# EAGLE design untitled (EAGLE 7.2.0)
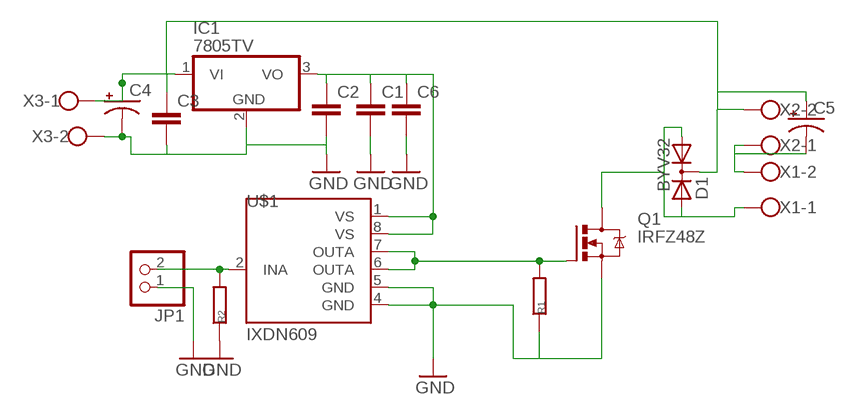
[diagram p0: schematic, sheet 1]

## Parts
C1  CC0805  [C0805]
C2  CC0805  [C0805]
C3  CC0805  [C0805]
C4  CAP_POLPTH4  [CPOL-RADIAL-1000UF-25V]
C5  CAP_POLPTH4  [CPOL-RADIAL-1000UF-25V]
C6  CC0805  [C0805]
D1  BYV32  [TO220ABS]
IC1  7805TV  [TO220V]
JP1  PINHD-1X2  [1X02]
Q1  IRFZ48Z  [TO220BH]
R1  R0805  [R0805]
R2  R0805  [R0805]
U$1  IXDN609  [SO08]
X1  W237-102  [W237-102]
X2  W237-102  [W237-102]
X3  W237-102  [W237-102]

## Nets
GND: C1.2 C2.2 C3.2 C4.- C6.2 IC1.2(GND) JP1.1 Q1.S R1.1 R2.1 U$1.4(GND) U$1.5(GND) X3.2
N$1: D1.A1 D1.A2 Q1.D X1.1
N$2: C1.1 C2.1 C6.1 IC1.3(VO) U$1.1(VS) U$1.8(VS)
N$3: Q1.G R1.2 U$1.6(OUTA) U$1.7(OUTA)
N$4: JP1.2 R2.2 U$1.2(INA)
N$6: C3.1 C4.+ C5.+ D1.C IC1.1(VI) X2.2 X3.1
N$8: C5.- X1.2 X2.1

## Library data of the parts
C1-C3 C6 = CasaLibrary:C: Capacitor
C4 C5 = SparkFun-Capacitors:CAP_POL: Capacitor Polarized These are standard SMD and PTH capacitors. Normally 10uF, 47uF, and 100uF in electrolytic and tantalum varieties. Always verify the external diameter of the through hole cap, it varies with capacity, voltage, and manufacturer. The EIA devices should be standard.
D1 = diode:BYV32: DIODE 2 x Si diode 200 V, 20 A/230 Apeak, 25 ns
IC1 = linear:78*: Positive VOLTAGE REGULATOR Source: http://cache.national.com/ds/LM/LM78L05.pdf http://www.fairchildsemi.com/ds/LM/LM7805.pdf
JP1 = pinhead:PINHD-1X2: PIN HEADER
Q1 = transistor-power:IRFZ48: N Channel HEXFET® Power MOSFET Logic Level Source: http://www.irf.com/product-info/datasheets/data/irfz48z.pdf
R1 R2 = CasaLibrary:R
U$1 = CasaLibrary:IXDN609
X1-X3 = con-wago-500:W237-102: WAGO SCREW CLAMP; MPN: 237-102; OC_FARNELL: unknown; OC_NEWARK: 70K9898

## Board
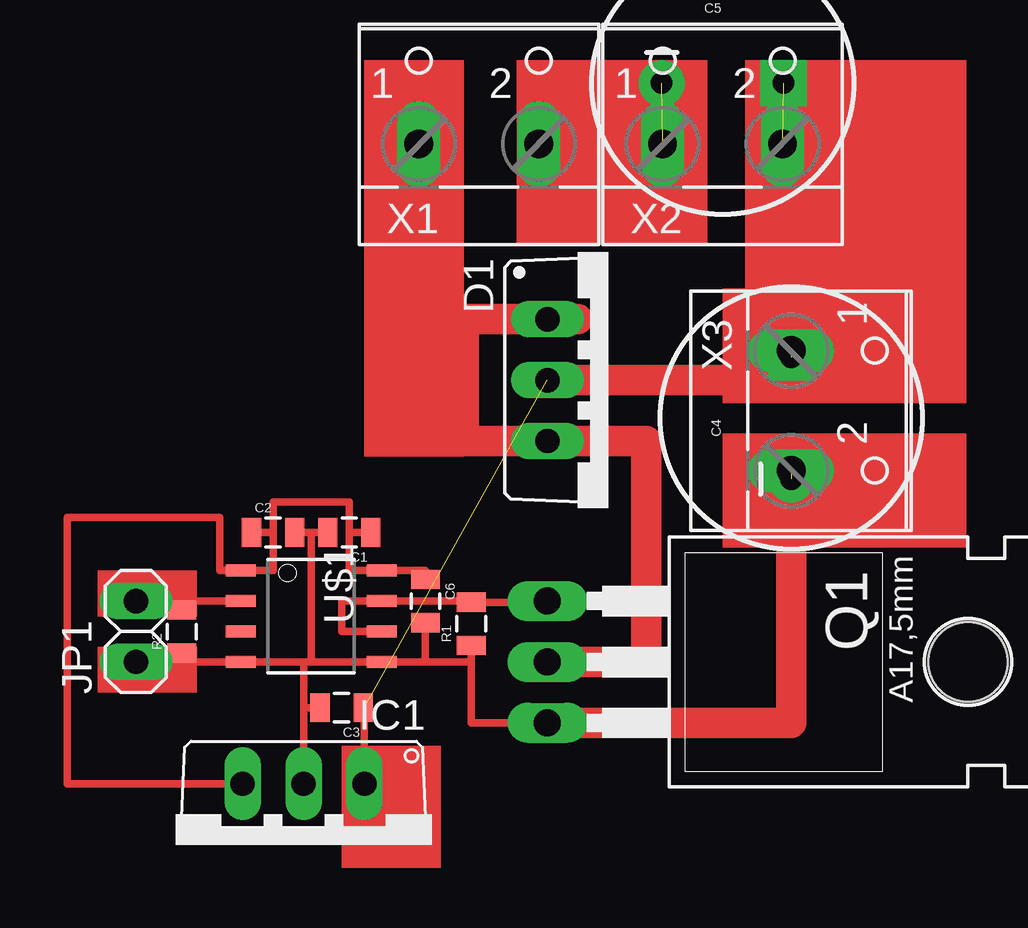
[diagram p1: board, top side]

No outline drawn. Coordinates in mm, seen from the top.
Copper layers (1*16): Top 0.035mm / dielectric 1.5mm / Bottom 0.035mm
Design rules "default": minimum track width 0.2mm, minimum drill 0.2mm, track to track 0.2mm, track to pad 0.2mm, pad to pad 0.2mm, via to via 0.2mm, smd to smd 0.2mm, copper to edge 0.2mm, drill to drill 0.2mm, minimum pad ring 10mil, minimum via ring 8mil, stop-mask expansion 4mil, vias tented up to drill 0mil, thermal gap 10mil

### Footprints (pad centres in the part's own frame; a part is rotated, then mirrored left to right if it is on the bottom)
C0805 = smd 0.8 x 1.2: 1 -0.9,0; 2 0.9,0
CPOL-RADIAL-1000UF-25V = drill 0.9 pad 1.93 square: + 2.54,0 | drill 0.9 pad 1.93: - -2.54,0
TO220ABS = drill 1.016 long: A1 -2.54,-2.54; A2 2.54,-2.54; C 0,-2.54
TO220V = drill 1.016 long: 1 -2.54,-2.54; 2 0,-2.54; 3 2.54,-2.54
1X02 = drill 1.016 long: 1 -1.27,0; 2 1.27,0
TO220BH = drill 1.118 long: D 0,-6.35; G -2.54,-6.35; S 2.54,-6.35 | hole 3.302: 0,11.176
R0805 = smd 0.8 x 1.2: 1 -0.9,0; 2 0.9,0
SO08 = smd 0.5 x 1.25: 1 -1.905,-2.934; 2 -0.635,-2.934; 3 0.635,-2.934; 4 1.905,-2.934; 5 1.905,2.934; 6 0.635,2.934; 7 -0.635,2.934; 8 -1.905,2.934
W237-102 = drill 1.194 long: 1 -2.5,-1.27; 2 2.5,-1.27

### Placement (x,y rotation side)
C1  12.06,10.48 180 top
C2  8.89,10.48 0 top
C3  11.75,3.17 180 top
C4  30.48,15.24 90 top
C5  27.62,29.21 0 top
C6  15.24,7.62 270 top
D1  22.86,16.83 270 top
IC1  10.16,-2.54 180 top
JP1  3.17,6.35 90 top
Q1  26.67,5.08 270 top
R1  17.14,6.67 90 top
R2  5.08,6.35 90 top
U$1  10.48,6.99 270 top
X1  17.46,27.94 0 top
X2  27.62,27.94 0 top
X3  31.75,15.56 270 top

### Tracks (layer width: path | path; a pad name or v marks a point on that pad's centre or on a via)
GND  (1 unrouted)
  Top 0.305: 5.08,5.08 U$1.4 10.16,5.08 | 5.08,5.08 JP1.1 | 10.48,5.08 U$1.5 15.24,5.08 | 10.48,5.08 10.16,5.08 | 10.48,10.48 10.48,5.08 | C2.2 10.48,10.48 | C1.2 10.48,10.48 | IC1.2 10.16,3.17 | 10.16,3.17 10.16,5.08 | C3.2 10.16,3.17 | C6.2 15.24,5.08 | 15.24,5.08 17.14,5.08 R1.1 17.14,2.54 Q1.S | R2.1 5.08,5.08
  Top 1.27: X3.2 30.48,2.54 Q1.S
N$1
  Top 1.27: Q1.D 24.45,5.08 24.45,14.29 D1.A2 16.83,14.29 16.83,19.37 D1.A1 | D1.A1 21.59,19.37 | D1.A1 14.96,19.37 X1.1
N$2
  Top 0.305: C1.1 12.06,10.48 | 12.06,10.48 12.06,8.89 U$1.8 15.24,8.89 C6.1 | 8.89,10.48 8.89,8.89 U$1.1 6.67,8.89 6.67,11.11 0.32,11.11 0.32,0 IC1.3 | C2.1 8.89,10.48 | 8.89,10.48 8.89,11.75 12.06,11.75 12.06,10.48
N$3
  Top 0.305: U$1.6 11.75,6.35 11.75,7.62 U$1.7 17.14,7.62 R1.2 20.32,7.57 Q1.G
N$4
  Top 0.305: JP1.2 5.4,7.62 | 5.4,7.62 U$1.2 | R2.2 5.4,7.25 5.4,7.62
N$6  (3 unrouted)
  Top 0.305: C3.1 12.7,3.17 IC1.1 12.7,-3.17 | C4.+ 30.16,17.78 30.16,18.73
  Top 1.27: X2.2 30.12,19.33 30.16,19.01 30.16,18.73 30.16,16.83 D1.C
N$8  (1 unrouted)
  Top 1.27: X1.2 X2.1
(copper drawn outside any net)
  shapes: Top area x22